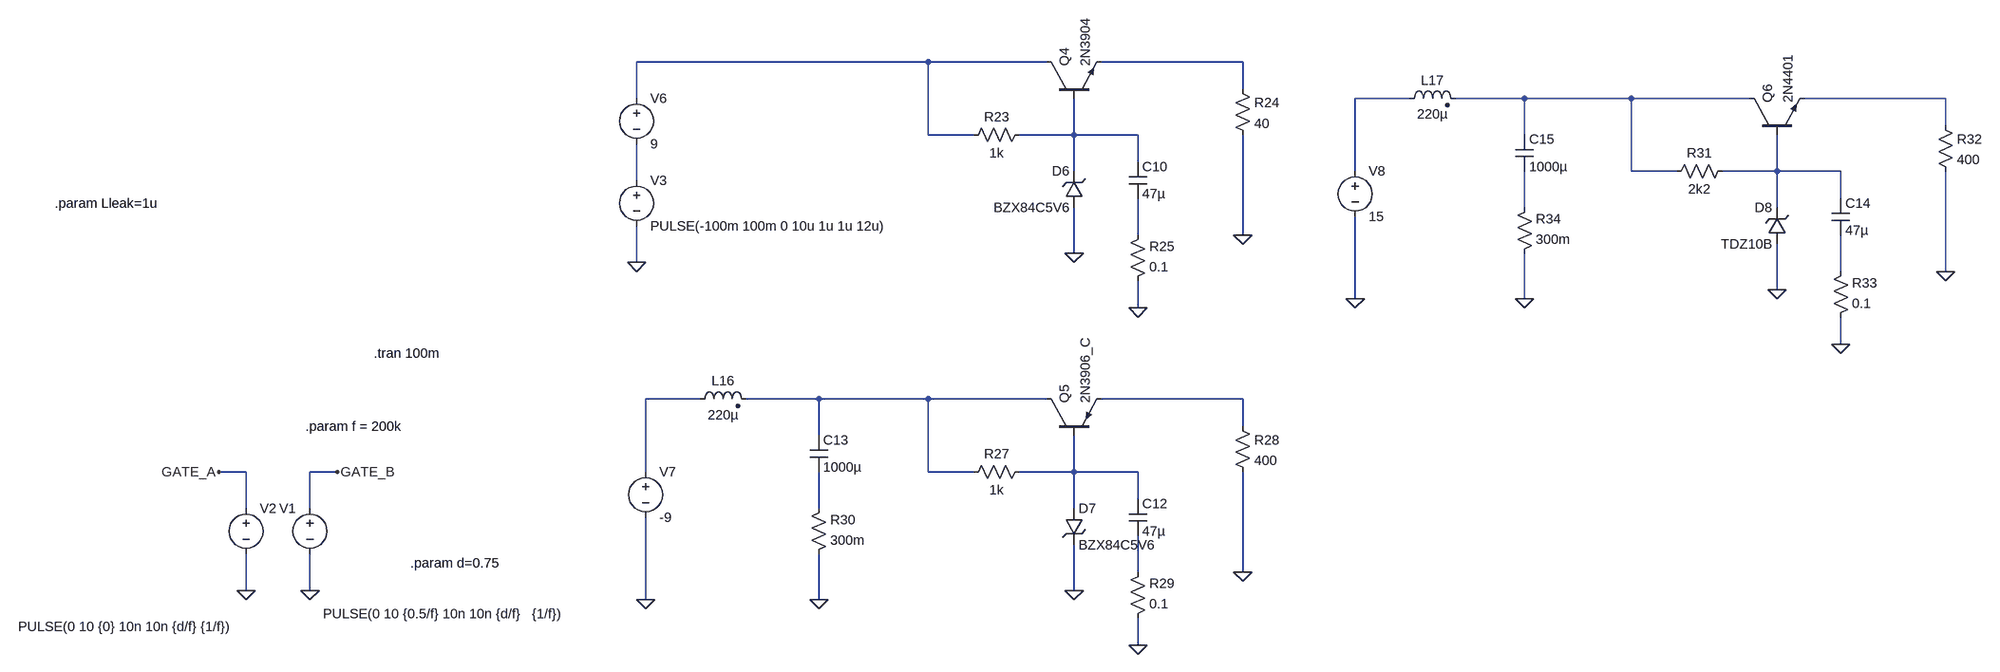
[diagram p0: schematic 102_caps.asc]
102_caps.asc, the LTspice schematic file:
Version 4
SHEET 1 4996 680
WIRE 2864 -1120 2352 -1120
WIRE 3072 -1120 2864 -1120
WIRE 3536 -1120 3168 -1120
WIRE 3536 -1072 3536 -1120
WIRE 2352 -1056 2352 -1120
WIRE 3856 -1056 3760 -1056
WIRE 4064 -1056 3936 -1056
WIRE 4256 -1056 4064 -1056
WIRE 4464 -1056 4256 -1056
WIRE 4928 -1056 4560 -1056
WIRE 4928 -1008 4928 -1056
WIRE 2864 -992 2864 -1120
WIRE 2944 -992 2864 -992
WIRE 3120 -992 3120 -1056
WIRE 3120 -992 3024 -992
WIRE 3232 -992 3120 -992
WIRE 4064 -992 4064 -1056
WIRE 3232 -944 3232 -992
WIRE 3120 -928 3120 -992
WIRE 3760 -928 3760 -1056
WIRE 4256 -928 4256 -1056
WIRE 4336 -928 4256 -928
WIRE 4512 -928 4512 -992
WIRE 4512 -928 4416 -928
WIRE 4624 -928 4512 -928
WIRE 2352 -912 2352 -976
WIRE 4624 -880 4624 -928
WIRE 4064 -864 4064 -928
WIRE 4512 -864 4512 -928
WIRE 3232 -816 3232 -880
WIRE 3536 -816 3536 -992
WIRE 3120 -784 3120 -864
WIRE 2352 -768 2352 -832
WIRE 4624 -752 4624 -816
WIRE 4928 -752 4928 -928
WIRE 4512 -720 4512 -800
WIRE 3760 -704 3760 -848
WIRE 4064 -704 4064 -784
WIRE 3232 -688 3232 -736
WIRE 4624 -624 4624 -672
WIRE 2464 -528 2368 -528
WIRE 2672 -528 2544 -528
WIRE 2864 -528 2672 -528
WIRE 3072 -528 2864 -528
WIRE 3536 -528 3168 -528
WIRE 3536 -480 3536 -528
WIRE 2672 -464 2672 -528
WIRE -2672 -400 -2720 -400
WIRE -2512 -400 -2560 -400
WIRE 2368 -400 2368 -528
WIRE 2864 -400 2864 -528
WIRE 2944 -400 2864 -400
WIRE 3120 -400 3120 -464
WIRE 3120 -400 3024 -400
WIRE 3232 -400 3120 -400
WIRE 3232 -352 3232 -400
WIRE -2672 -336 -2672 -400
WIRE -2560 -336 -2560 -400
WIRE 2672 -336 2672 -400
WIRE 3120 -336 3120 -400
WIRE 3232 -224 3232 -288
WIRE 3536 -224 3536 -400
WIRE -2672 -192 -2672 -256
WIRE -2560 -192 -2560 -256
WIRE 3120 -192 3120 -272
WIRE 2368 -176 2368 -320
WIRE 2672 -176 2672 -256
WIRE 3232 -96 3232 -144
FLAG -2560 -192 0
FLAG -2512 -400 GATE_B
FLAG -2720 -400 GATE_A
FLAG -2672 -192 0
FLAG 3120 -784 0
FLAG 3536 -816 0
FLAG 3232 -688 0
FLAG 2352 -768 0
FLAG 3120 -192 0
FLAG 3536 -224 0
FLAG 3232 -96 0
FLAG 2368 -176 0
FLAG 2672 -176 0
FLAG 4512 -720 0
FLAG 4928 -752 0
FLAG 4624 -624 0
FLAG 3760 -704 0
FLAG 4064 -704 0
SYMBOL voltage -2560 -352 M0
WINDOW 123 0 0 Left 0
WINDOW 39 0 0 Left 0
WINDOW 3 -444 201 Left 2
SYMATTR Value PULSE(0 10 {0.5/f} 10n 10n {d/f}   {1/f})
SYMATTR InstName V1
SYMBOL voltage -2672 -352 R0
WINDOW 123 0 0 Left 0
WINDOW 39 0 0 Left 0
WINDOW 3 -400 224 Left 2
SYMATTR Value PULSE(0 10 {0} 10n 10n {d/f} {1/f})
SYMATTR InstName V2
SYMBOL npn 3072 -1056 R270
SYMATTR InstName Q4
SYMATTR Value 2N3904
SYMBOL res 3040 -1008 R90
WINDOW 0 0 56 VBottom 2
WINDOW 3 32 56 VTop 2
SYMATTR InstName R23
SYMATTR Value 1k
SYMBOL zener 3136 -864 R180
WINDOW 0 24 64 Left 2
WINDOW 3 24 0 Left 2
SYMATTR InstName D6
SYMATTR Value BZX84C5V6
SYMATTR Description Diode
SYMATTR Type diode
SYMBOL res 3520 -1088 R0
SYMATTR InstName R24
SYMATTR Value 40
SYMBOL cap 3216 -944 R0
SYMATTR InstName C10
SYMATTR Value 47µ
SYMBOL res 3216 -720 M180
WINDOW 0 36 76 Left 2
WINDOW 3 36 40 Left 2
SYMATTR InstName R25
SYMATTR Value 0.1
SYMBOL voltage 2352 -1072 R0
WINDOW 123 0 0 Left 0
WINDOW 39 0 0 Left 0
SYMATTR InstName V6
SYMATTR Value 9
SYMBOL res 3040 -416 R90
WINDOW 0 0 56 VBottom 2
WINDOW 3 32 56 VTop 2
SYMATTR InstName R27
SYMATTR Value 1k
SYMBOL zener 3104 -336 R0
SYMATTR InstName D7
SYMATTR Value BZX84C5V6
SYMATTR Description Diode
SYMATTR Type diode
SYMBOL res 3520 -496 R0
SYMATTR InstName R28
SYMATTR Value 400
SYMBOL cap 3216 -352 R0
SYMATTR InstName C12
SYMATTR Value 47µ
SYMBOL res 3216 -128 M180
WINDOW 0 36 76 Left 2
WINDOW 3 36 40 Left 2
SYMATTR InstName R29
SYMATTR Value 0.1
SYMBOL voltage 2368 -416 R0
WINDOW 123 0 0 Left 0
WINDOW 39 0 0 Left 0
SYMATTR InstName V7
SYMATTR Value -9
SYMBOL ind2 2448 -512 R270
WINDOW 0 32 56 VTop 2
WINDOW 3 4 56 VBottom 2
SYMATTR InstName L16
SYMATTR Value 220µ
SYMATTR Type ind
SYMATTR SpiceLine Rser=0.2
SYMBOL cap 2656 -464 R0
SYMATTR InstName C13
SYMATTR Value 1000µ
SYMBOL res 2656 -240 M180
WINDOW 0 36 76 Left 2
WINDOW 3 36 40 Left 2
SYMATTR InstName R30
SYMATTR Value 300m
SYMBOL pnp 3072 -464 R270
SYMATTR InstName Q5
SYMATTR Value 2N3906_C
SYMBOL npn 4464 -992 R270
SYMATTR InstName Q6
SYMATTR Value 2N4401
SYMBOL res 4432 -944 R90
WINDOW 0 0 56 VBottom 2
WINDOW 3 32 56 VTop 2
SYMATTR InstName R31
SYMATTR Value 2k2
SYMBOL zener 4528 -800 R180
WINDOW 0 24 64 Left 2
WINDOW 3 24 0 Left 2
SYMATTR InstName D8
SYMATTR Value TDZ10B
SYMATTR Description Diode
SYMATTR Type diode
SYMBOL res 4912 -1024 R0
SYMATTR InstName R32
SYMATTR Value 400
SYMBOL cap 4608 -880 R0
SYMATTR InstName C14
SYMATTR Value 47µ
SYMBOL res 4608 -656 M180
WINDOW 0 36 76 Left 2
WINDOW 3 36 40 Left 2
SYMATTR InstName R33
SYMATTR Value 0.1
SYMBOL voltage 3760 -944 R0
WINDOW 123 0 0 Left 0
WINDOW 39 0 0 Left 0
SYMATTR InstName V8
SYMATTR Value 15
SYMBOL ind2 3840 -1040 R270
WINDOW 0 32 56 VTop 2
WINDOW 3 4 56 VBottom 2
SYMATTR InstName L17
SYMATTR Value 220µ
SYMATTR Type ind
SYMATTR SpiceLine Rser=0.2
SYMBOL cap 4048 -992 R0
SYMATTR InstName C15
SYMATTR Value 1000µ
SYMBOL res 4048 -768 M180
WINDOW 0 36 76 Left 2
WINDOW 3 36 40 Left 2
SYMATTR InstName R34
SYMATTR Value 300m
SYMBOL voltage 2352 -928 R0
WINDOW 123 0 0 Left 0
WINDOW 39 0 0 Left 0
SYMATTR InstName V3
SYMATTR Value PULSE(-100m 100m 0 10u 1u 1u 12u)
TEXT -2448 -608 Left 2 !.tran 100m
TEXT -2568 -480 Left 2 !.param f = 200k
TEXT -3008 -872 Left 2 !.param Lleak=1u
TEXT -2384 -240 Left 2 !.param d=0.75

The netlist it stands for:
* 102_caps.asc
V1 GATE_B 0 PULSE(0 10 {0.5/f} 10n 10n {d/f}   {1/f})
V2 GATE_A 0 PULSE(0 10 {0} 10n 10n {d/f} {1/f})
Q4 N001 N006 N002 0 2N3904
R23 N006 N001 1k
D6 0 N006 BZX84C5V6
R24 N002 0 40
C10 N006 N010 47µ
R25 0 N010 0.1
V6 N001 N008 9
R27 N015 N013 1k
D7 N015 0 BZX84C5V6
R28 N014 0 400
C12 N015 N017 47µ
R29 0 N017 0.1
V7 N012 0 -9
L16 N012 N013 220µ Rser=0.2
C13 N013 N016 1000µ
R30 0 N016 300m
Q5 N013 N015 N014 0 2N3906_C
Q6 N004 N007 N005 0 2N4401
R31 N007 N004 2k2
D8 0 N007 TDZ10B
R32 N005 0 400
C14 N007 N011 47µ
R33 0 N011 0.1
V8 N003 0 15
L17 N003 N004 220µ Rser=0.2
C15 N004 N009 1000µ
R34 0 N009 300m
V3 N008 0 PULSE(-100m 100m 0 10u 1u 1u 12u)
.model D D
.lib standard.dio
.model NPN NPN
.model PNP PNP
.lib standard.bjt
.tran 100m
.param f = 200k
.param Lleak=1u
.param d=0.75
.backanno
.end